# EAGLE schematic JACart2 (EAGLE 9.6.2)
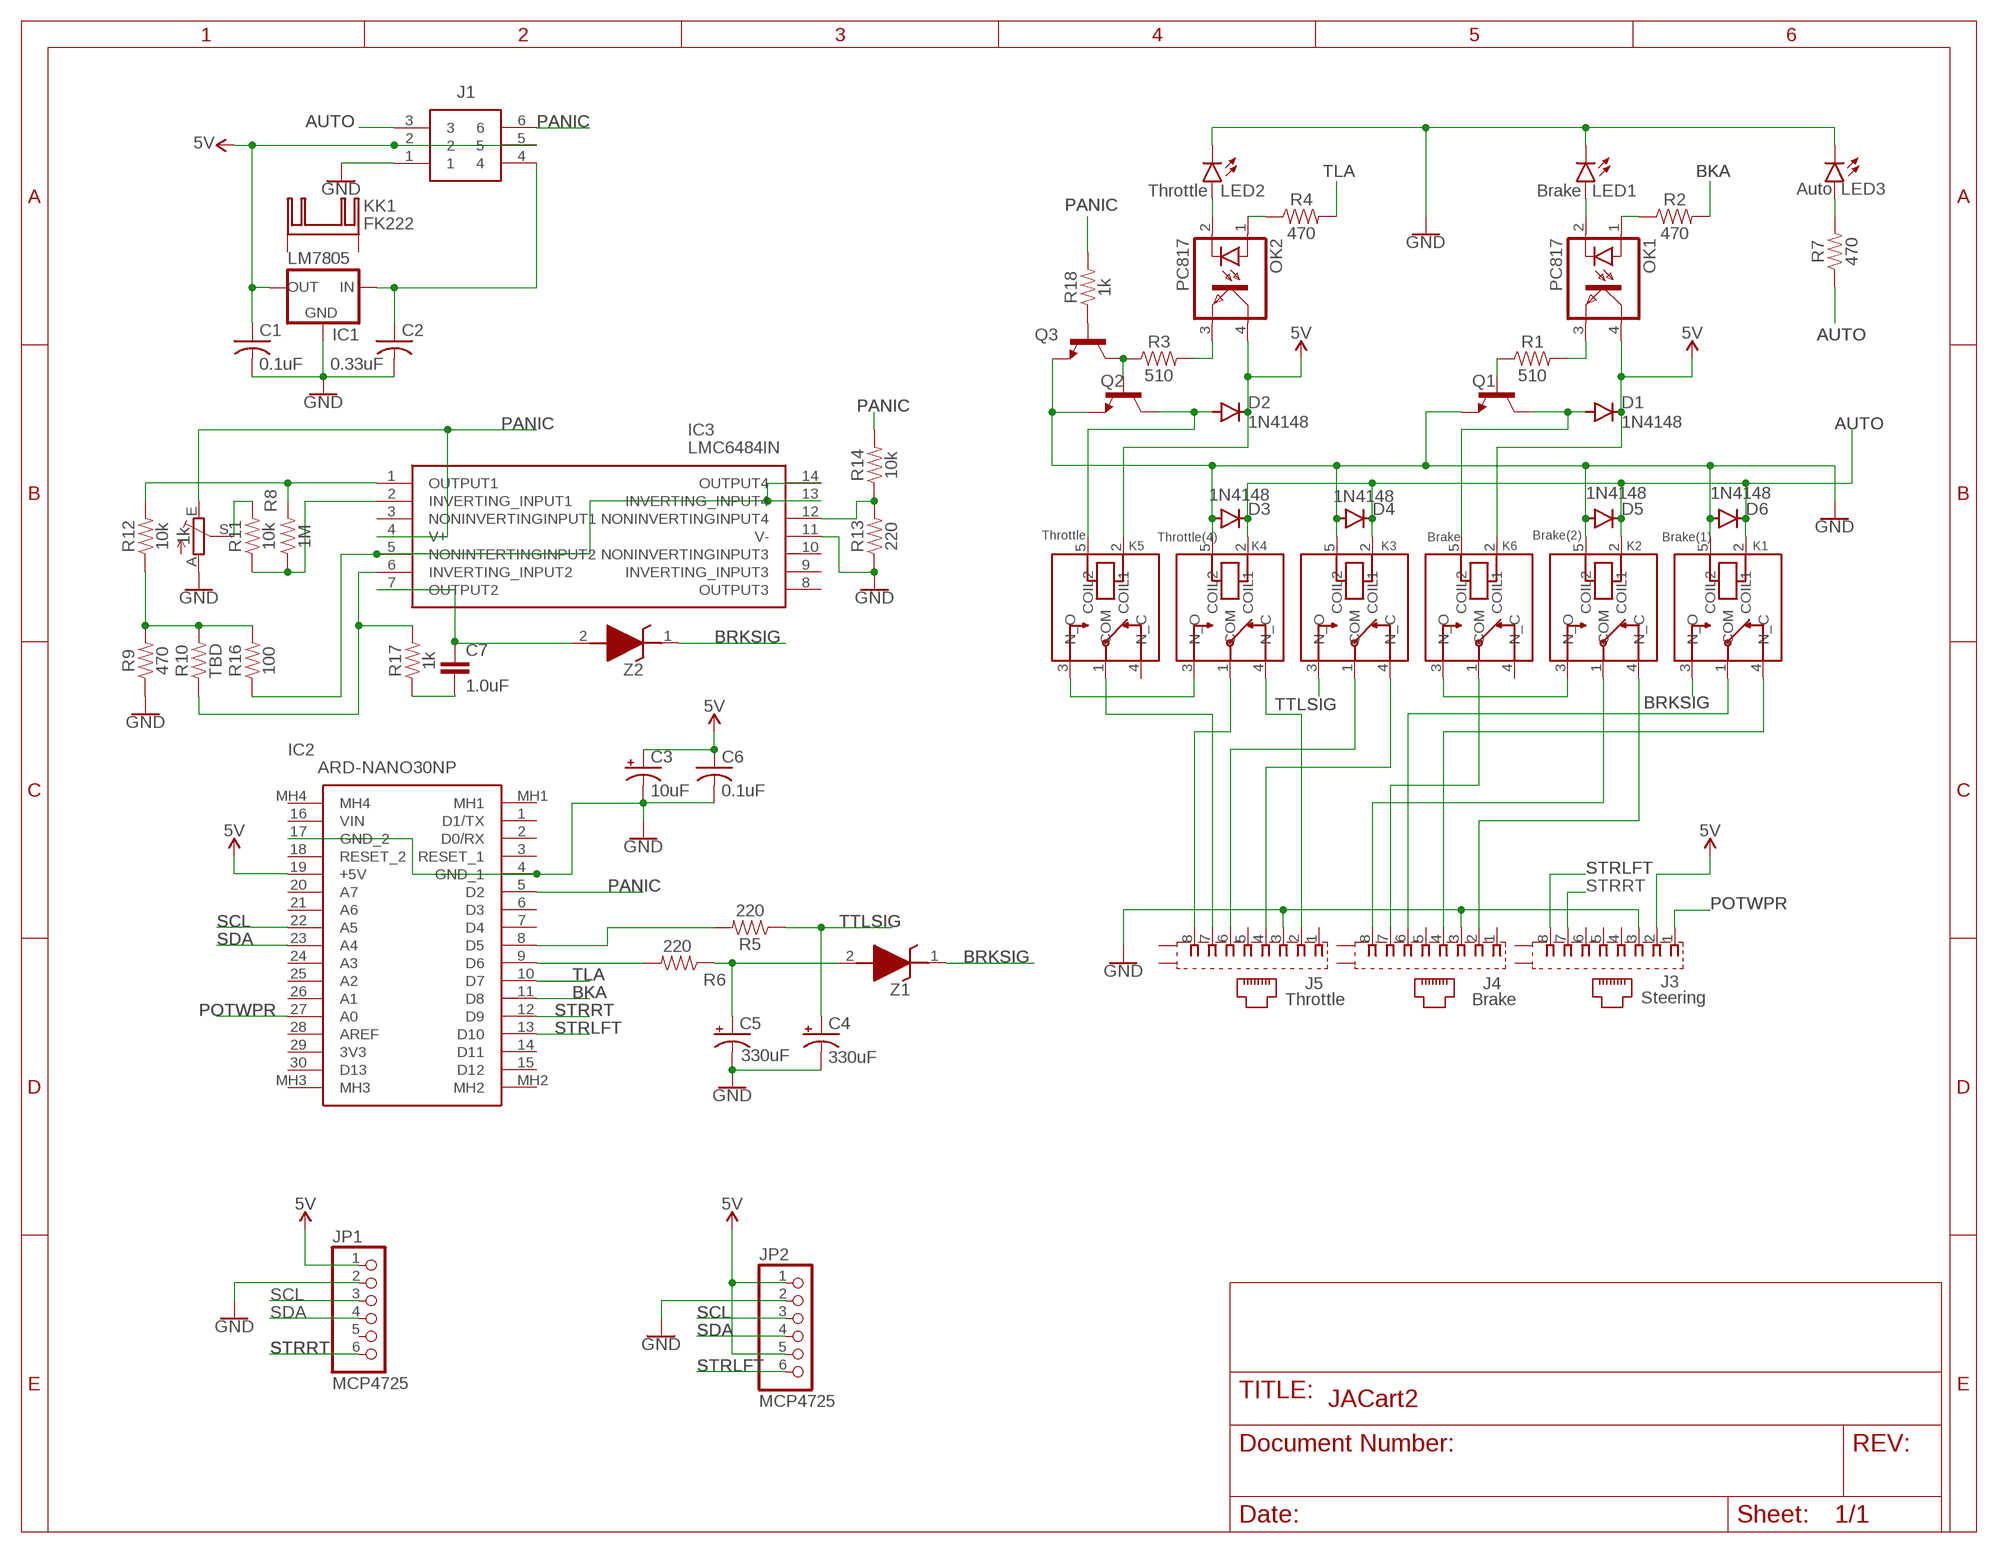
[diagram p0: schematic, sheet 1]

## Parts
C1  0.1uF  C-US050-024X044  [C050-024X044]
C2  0.33uF  C-US050-024X044  [C050-024X044]
C3  10uF  10UF-POLAR-RADIAL-2.5MM-25V-20%  [CPOL-RADIAL-2.5MM-5MM]
C4  330uF  330UF-PA  [PANASONIC_A]
C5  330uF  330UF-PA  [PANASONIC_A]
C6  0.1uF  C-US050-024X044  [C050-024X044]
C7  1.0uF  0.1UF-KIT-EZ-50V-20%  [CAP-PTH-SMALL-KIT]
D1  1N4148  1N4148DO35-7  [DO35-7]
D2  1N4148  1N4148DO35-7  [DO35-7]
D3  1N4148  1N4148DO35-7  [DO35-7]
D4  1N4148  1N4148DO35-7  [DO35-7]
D5  1N4148  1N4148DO35-7  [DO35-7]
D6  1N4148  1N4148DO35-7  [DO35-7]
IC1  LM7805  7805-VR  [78XXS]
IC2  ARD-NANO30NP  [ARDNANO30NP]
IC3  LMC6484IN  [DIP794W56P254L1905H533Q14N]
J1  39-30-1060  [39-30-1060_1]
J3  Steering  RJ45-RTANGL  [GLX-S-88M]
J4  Brake  RJ45-RTANGL  [GLX-S-88M]
J5  Throttle  RJ45-RTANGL  [GLX-S-88M]
JP1  MCP4725  HEADER-1X670MIL  [1X06_ROUND_70]
JP2  MCP4725  HEADER-1X670MIL  [1X06_ROUND_70]
K1  Brake(1)  RELAY-SPDT  [RELAY_JS1-5V-F]
K2  Brake(2)  RELAY-SPDT  [RELAY_JS1-5V-F]
K3  Throttle(3)  RELAY-SPDT  [RELAY_JS1-5V-F]
K4  Throttle(4)  RELAY-SPDT  [RELAY_JS1-5V-F]
K5  Throttle  RELAY-SPDT  [RELAY_JS1-5V-F]
K6  Brake  RELAY-SPDT  [RELAY_JS1-5V-F]
KK1  FK222  [FK222]
LED1  Brake  LED5MM  [LED_5MM]
LED2  Throttle  LED5MM  [LED_5MM]
LED3  Auto  LED5MM  [LED_5MM]
OK1  PC817  [DIL04]
OK2  PC817  [DIL04]
Q1  2N3904  [TO92]
Q2  2N3904  [TO92]
Q3  2N3904  [TO92]
R1  510  RESISTORAXIAL-0.3  [AXIAL-0.3]
R2  470  RESISTORAXIAL-0.3  [AXIAL-0.3]
R3  510  RESISTORAXIAL-0.3  [AXIAL-0.3]
R4  470  RESISTORAXIAL-0.3  [AXIAL-0.3]
R5  220  RESISTORAXIAL-0.3  [AXIAL-0.3]
R6  220  RESISTORAXIAL-0.3  [AXIAL-0.3]
R7  470  RESISTORAXIAL-0.3  [AXIAL-0.3]
R8  1M  RESISTORAXIAL-0.3  [AXIAL-0.3]
R9  470  RESISTORAXIAL-0.3  [AXIAL-0.3]
R10  TBD  RESISTORAXIAL-0.3  [AXIAL-0.3]
R11  10k  RESISTORAXIAL-0.3  [AXIAL-0.3]
R12  10k  RESISTORAXIAL-0.3  [AXIAL-0.3]
R13  220  RESISTORAXIAL-0.3  [AXIAL-0.3]
R14  10k  RESISTORAXIAL-0.3  [AXIAL-0.3]
R15  1k  TRIM_EU-RJ9W  [RJ9W]
R16  100  RESISTORAXIAL-0.3  [AXIAL-0.3]
R17  1k  RESISTORAXIAL-0.3  [AXIAL-0.3]
R18  1k  RESISTORAXIAL-0.3  [AXIAL-0.3]
Z1  BAT85S-TR  [DIOAD950W60L350D150]
Z2  BAT85S-TR  [DIOAD950W60L350D150]

## Nets
5V: C1.1 C3.1(+) C6.1 D1.C D2.C IC1.OUT IC2.19(+5V) J1.2 J1.5 J3.2 JP1.1 JP2.1 JP2.5 K5.2(COIL1) K6.2(COIL1) OK1.4(COL) OK2.4(COL)
AUTO: D3.C D4.C D5.C D6.C J1.3 K1.2(COIL1) K2.2(COIL1) K3.2(COIL1) K4.2(COIL1) R7.P$1
BKA: IC2.11(D8) R2.P$2
BRKSIG: K1.3(N_O) Z1.1(K) Z2.1(K)
GND: C1.2 C2.2 C3.2(-) C4.- C5.- C6.2 D3.A D4.A D5.A D6.A IC1.GND IC2.4(GND_1) IC2.17(GND_2) IC3.11(V-) J1.1 J3.3 J4.3 J5.3 JP1.2 JP2.2 K1.5(COIL2) K2.5(COIL2) K3.5(COIL2) K4.5(COIL2) LED1.K(C) LED2.K(C) LED3.K(C) Q1.3(E) Q2.3(E) Q3.3(E) R9.P$1 R13.P$1 R15.A
N$1: C2.1 IC1.IN J1.4
N$2: D1.A K6.5(COIL2) Q1.1(C)
N$3: OK2.1(A) R4.P$1
N$4: LED3.A R7.P$2
N$5: OK2.3(EMIT) R3.P$2
N$6: Q2.2(B) Q3.1(C) R3.P$1
N$7: OK1.1(A) R2.P$1
N$8: LED2.A OK2.2(C)
N$9: LED1.A OK1.2(C)
N$10: IC2.9(D6) R6.P$2
N$11: IC2.8(D5) R5.P$2
N$12: OK1.3(EMIT) R1.P$2
N$13: Q1.2(B) R1.P$1
N$14: D2.A K5.5(COIL2) Q2.1(C)
N$15: J5.4 K3.4(N_C)
N$16: R9.P$2 R10.P$2 R12.P$1 R16.P$2
N$17: K2.3(N_O) K6.3(N_O)
N$18: K4.3(N_O) K5.3(N_O)
N$19: J5.7 K5.1(COM)
N$20: J5.8 K4.1(COM)
N$21: J5.2 K4.4(N_C)
N$22: J5.6 K3.1(COM)
N$23: J4.7 K6.1(COM)
N$24: J4.8 K2.1(COM)
N$25: J4.2 K2.4(N_C)
N$26: J4.6 K1.1(COM)
N$27: J4.4 K1.4(N_C)
N$28: IC3.1(OUTPUT1) R8.P$2 R12.P$2
N$29: IC3.2(INVERTING_INPUT1) R8.P$1 R11.P$1
N$30: IC3.5(NONINTERTINGINPUT2) IC3.13(INVERTING_INPUT4) IC3.14(OUTPUT4) R16.P$1
N$31: IC3.12(NONINVERTINGINPUT4) R13.P$2 R14.P$1
N$32: R11.P$2 R15.S
N$33: IC3.6(INVERTING_INPUT2) R10.P$1 R17.P$2
N$34: C7.1 IC3.7(OUTPUT2) Z2.2(A)
N$35: C7.2 R17.P$1
N$36: C5.+ R6.P$1 Z1.2(A)
N$37: Q3.2(B) R18.P$1
PANIC: IC2.5(D2) IC3.4(V+) J1.6 R14.P$2 R15.E R18.P$2
POTWPR: IC2.27(A0) J3.1
SCL: IC2.22(A5) JP1.3 JP2.3
SDA: IC2.23(A4) JP1.4 JP2.4
STRLFT: IC2.13(D10) J3.8 JP2.6
STRRT: IC2.12(D9) J3.7 JP1.6
TLA: IC2.10(D7) R4.P$2
TTLSIG: C4.+ K3.3(N_O) R5.P$1
Unconnected: IC2.1(D1/TX) IC2.2(D0/RX) IC2.3(RESET_1) IC2.6(D3) IC2.7(D4) IC2.14(D11) IC2.15(D12) IC2.16(VIN) IC2.18(RESET_2) IC2.20(A7) IC2.21(A6) IC2.24(A3) IC2.25(A2) IC2.26(A1) IC2.28(AREF) IC2.29(3V3) IC2.30(D13) IC2.MH1 IC2.MH2 IC2.MH3 IC2.MH4 IC3.3(NONINVERTINGINPUT1) IC3.8(OUTPUT3) IC3.9(INVERTING_INPUT3) IC3.10(NONINVERTINGINPUT3) J3.4 J3.5 J3.6 J3.S1 J3.S2 J4.1 J4.5 J4.S1 J4.S2 J5.1 J5.5 J5.S1 J5.S2 JP1.5 K5.4(N_C) K6.4(N_C) KK1.A2,8(K) KK1.B2,8(K)

## Library data of the parts
C1 C2 = JACartParts:C-US: CAPACITOR, American symbol
C3 = JACartParts:10UF-POLAR: 10.0µF polarized capacitors A capacitor is a passive two-terminal electrical component used to store electrical energy temporarily in an electric field.; PROD_ID: CAP-08440
C4 C5 = JACartParts:330UF-P: POLARIZED CAPACITOR, American symbol
C6 = JACartParts:C-US: CAPACITOR, American symbol; C6: 0.1uF
C7 = JACartParts:0.1UF: 0.1µF ceramic capacitors A capacitor is a passive two-terminal electrical component used to store electrical energy temporarily in an electric field.; PROD_ID: CAP-08370; VALUE: 0.1uF
D1-D6 = JACartParts:1N4148: DIODE high speed (Philips)
IC1 = JACartParts:7805-VR: VOLTAGE REGULATOR
IC2 = samacsys:ARD-NANO30NP: Development Boards & Kits - AVR Arduino Nano 3.1 W/ATMEGA328 NO-PIN Source: Datasheet <http://www.mouser.com/datasheet/2/595/Arduino_Nano3_0-220057.pdf>; DESCRIPTION: Development Boards & Kits - AVR Arduino Nano 3.1 W/ATMEGA328 NO-PIN; HEIGHT: 5mm; MANUFACTURER_NAME: Gravitech; MANUFACTURER_PART_NUMBER: ARD-NANO30NP; MOUSER_PART_NUMBER: 992-ARD-NANO30NP; MOUSER_PRICE-STOCK: https://www.mouser.co.uk/ProductDetail/Gravitech/ARD-NANO30NP?qs=Vxac6xGyzPlh7in3DWNTbQ%3D%3D
IC3 = JACartParts:LMC6484IN: OP Amps Source: Datasheet <http://www.ti.com/lit/gpn/lmc6484>; DESCRIPTION: OP Amps; HEIGHT: 5.334mm; MANUFACTURER_NAME: Texas Instruments; MANUFACTURER_PART_NUMBER: LMC6484IN; MOUSER_PART_NUMBER: 926-LMC6484IN; MOUSER_PRICE-STOCK: https://www.mouser.com/Search/Refine.aspx?Keyword=926-LMC6484IN
J1 = JACartParts:39-30-1060: 6 way r/a PCB header w/peg,Mini-Fit Jr Molex MINI-FIT JR. Series, Series Number 5569, 4.2mm Pitch 6 Way 2 Row Shrouded Right Angle PCB Header, Through Hole Source: Datasheet <https://www.molex.com/webdocs/datasheets/pdf/en-us/0039301060_PCB_HEADERS.pdf>; DESCRIPTION: 6 way r/a PCB header w/peg,Mini-Fit Jr Molex MINI-FIT JR. Series, Series Number 5569, 4.2mm Pitch 6 Way 2 Row Shrouded Right Angle PCB Header, Through Hole; HEIGHT: mm; MANUFACTURER_NAME: Molex; MANUFACTURER_PART_NUMBER: 39-30-1060; MOUSER_PART_NUMBER: 538-39-30-1060; MOUSER_PRICE-STOCK: https://www.mouser.co.uk/ProductDetail/Molex/39-30-1060?qs=tRPrwvvr%2FujbUr18ehTIWQ%3D%3D
J3 J5 = JACartParts:RJ45-RTANGL: Mod. Jack, Right Angle, 8 posiotion, 8 contatcs RJ45 Source: GLX-S-88M.pdf; OC_FARNELL: unknown; OC_NEWARK: unknown
J4 = JACartParts:RJ45-RTANGL: Mod. Jack, Right Angle, 8 posiotion, 8 contatcs RJ45 Source: GLX-S-88M.pdf; MF: J4; OC_FARNELL: unknown; OC_NEWARK: unknown
JP1 JP2 = microbuilder:HEADER-1X6: PIN HEADER
K1-K6 = JACartParts:RELAY-SPDT: Electromechanical Relay Single Pole Double Throw 5 Amps Dc/10 Amps Ac 5 Volt 69.4Ohm Through Hole Check prices <https://pricing.snapeda.com/search/part/JS1-5V-F/?ref=eda>; AVAILABILITY: Good; DESCRIPTION: General Purpose Relay SPDT (1 Form C) 5VDC Coil Through Hole; MF: Panasonic Electric; MP: JS1-5V-F; PACKAGE: DO-41 Panasonic; PRICE: None; PURCHASE-URL: https://pricing.snapeda.com/search/part/JS1-5V-F/?ref=eda
KK1 = JACartParts:FK222: HEATSINK manufacturer Fischer/distributor Buerklin
LED1-LED3 = JACartParts:LED: LED (Generic) Standard schematic elements and footprints for 5mm, 3mm, 1206, and 0603 sized LEDs. Generic LEDs with no color specified.
OK1 OK2 = JACartParts:PC817: SHARP OPTO COUPLER; MPN: PC817X4J000F; OC_FARNELL: 9707727; OC_NEWARK: 97K7059
Q1-Q3 = JACartParts:2N3904: NPN TRANSISTOR
R1-R14 R16-R18 = JACartParts:RESISTOR: Generic Resistor Package
R15 = pot:TRIM_EU-: POTENTIOMETER
Z1 Z2 = samacsys:BAT85S-TR: Schottky Diodes & Rectifiers 200mA 30 Volt 5.0 Amp IFSM Source: Datasheet <https://componentsearchengine.com/Datasheets/1/BAT85S-TR.pdf>; ARROW_PART_NUMBER: BAT85S-TR; ARROW_PRICE-STOCK: https://www.arrow.com/en/products/bat85s-tr/vishay; DESCRIPTION: Schottky Diodes & Rectifiers 200mA 30 Volt 5.0 Amp IFSM; HEIGHT: mm; MANUFACTURER_NAME: Vishay; MANUFACTURER_PART_NUMBER: BAT85S-TR; MOUSER_PART_NUMBER: 78-BAT85S; MOUSER_PRICE-STOCK: https://www.mouser.co.uk/ProductDetail/Vishay-Semiconductors/BAT85S-TR?qs=WLTup5mM6hhXwTYgVHMF2g%3D%3D